# Altium schematic sheet Analog.SchDoc
size 381 x 241 mm
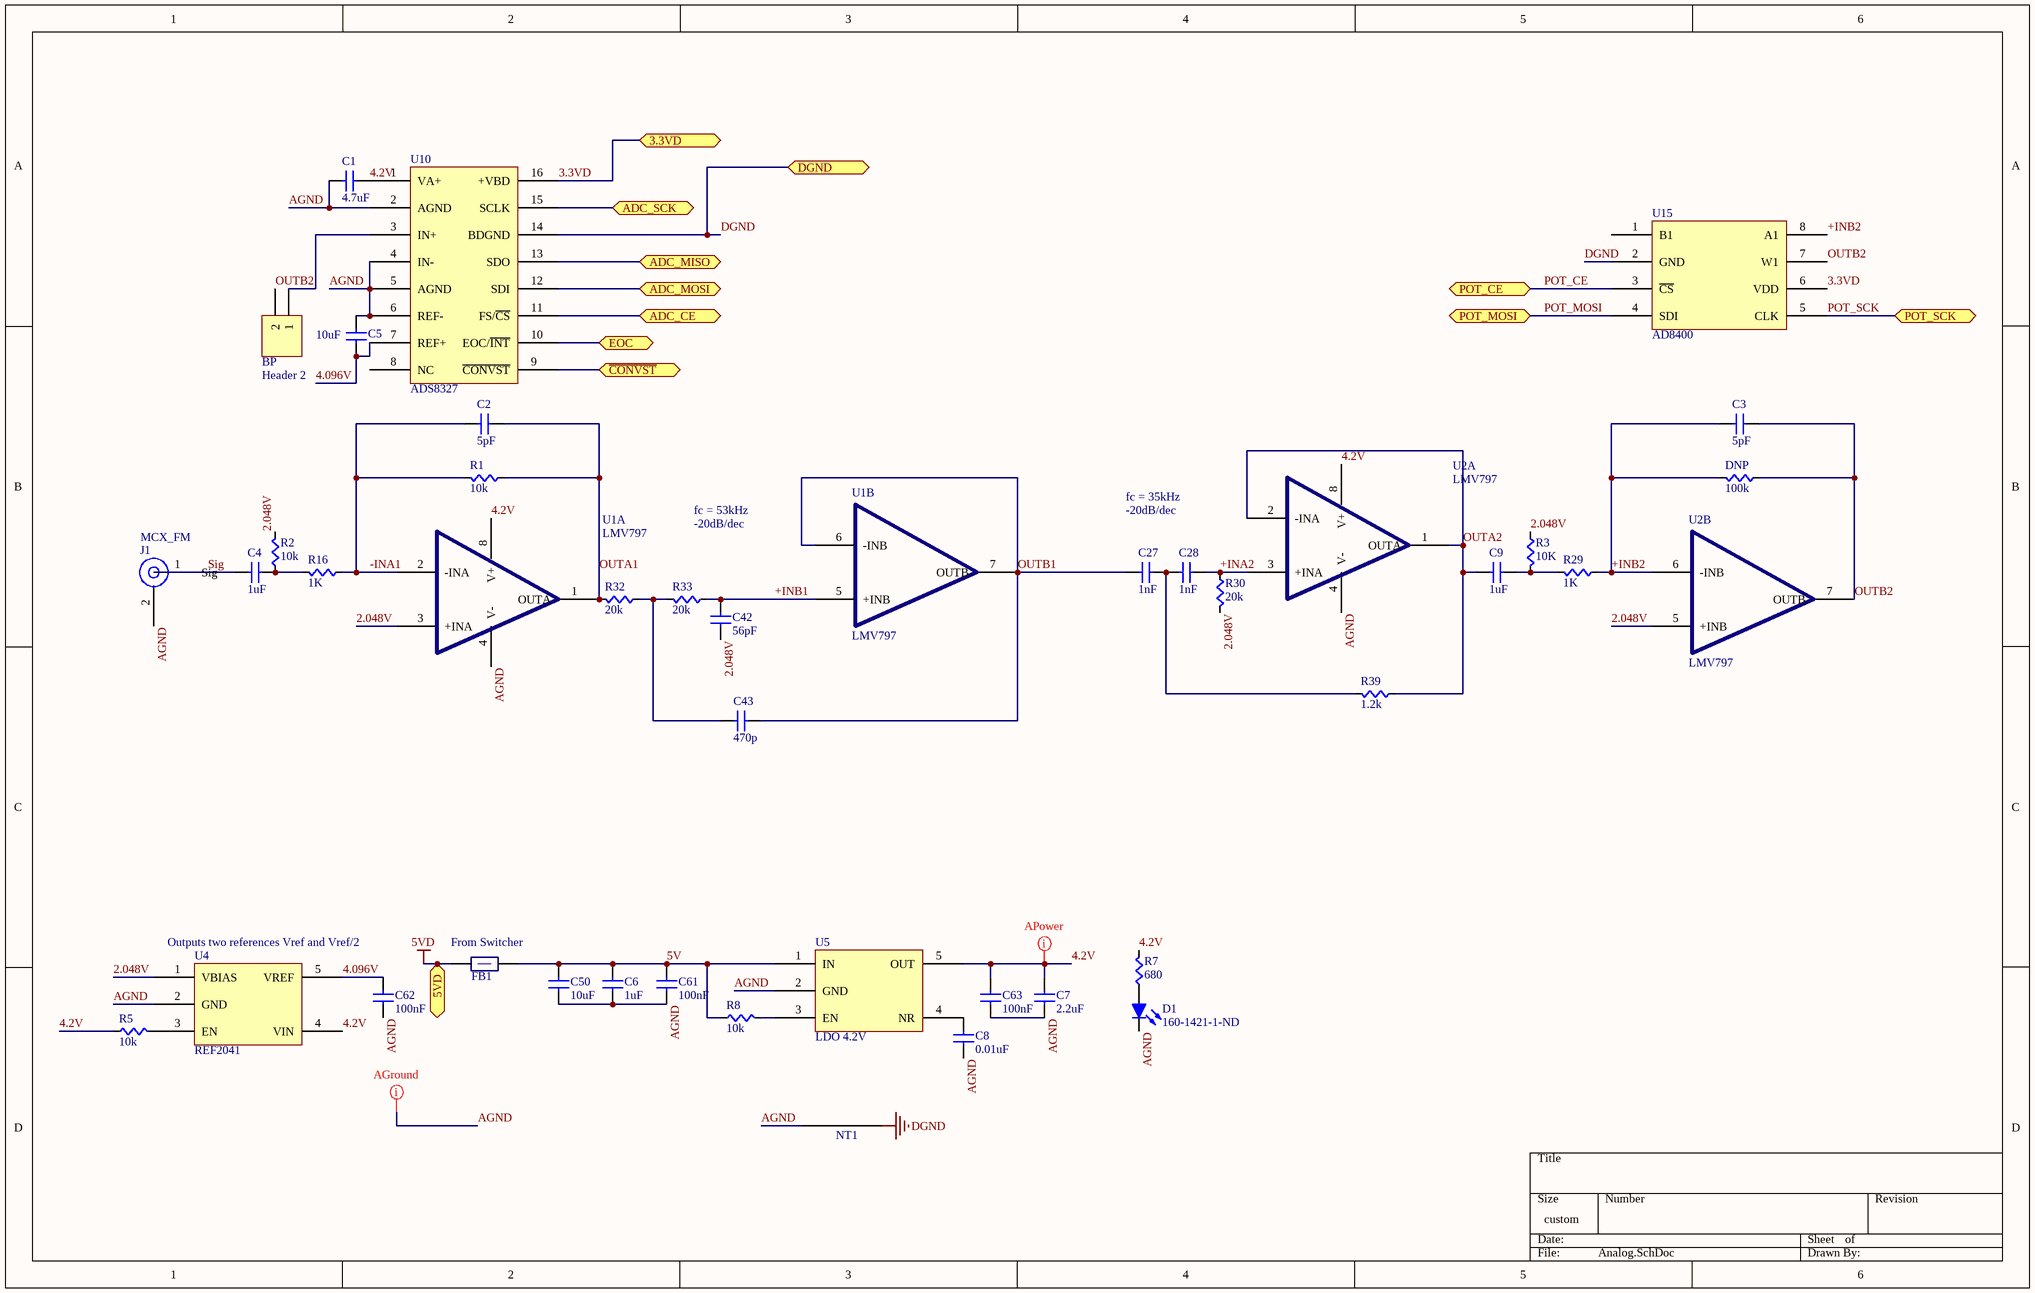
[diagram p0: Analog.SchDoc]

## Parts
BP  Header 2  [HDR1X2]
C1  value 4.7uF  [CAPC0603]  (hidden comment: Cap)
C2  value 5pF  [CAPC0603]  (hidden comment: Cap)
C3  value 5pF  [CAPC0603]  (hidden comment: Cap)
C4  value 1uF  [CAPC0603]  (hidden comment: Cap)
C5  value 10uF  [CAPC0603]  (hidden comment: Cap)
C6  value 1uF  [CAPC0603]  (hidden comment: Cap)
C7  value 2.2uF  [CAPC0603]  (hidden comment: Cap)
C8  value 0.01uF  [CAPC0603]  (hidden comment: Cap)
C9  value 1uF  [CAPC0603]  (hidden comment: Cap)
C27  value 1nF  [CAPC0603]  (hidden comment: Cap)
C28  value 1nF  [CAPC0603]  (hidden comment: Cap)
C42  value 56pF  [CAPC0603]  (hidden comment: Cap)
C43  value 470p  [CAPC0603]  (hidden comment: Cap)
C50  value 10uF  [CAPC0603]  (hidden comment: Cap)
C61  value 100nF  [CAPC0603]  (hidden comment: Cap)
C62  value 100nF  [CAPC0603]  (hidden comment: Cap)
C63  value 100nF  [CAPC0603]  (hidden comment: Cap)
D1  Supplier Part Number 1: 160-1421-1-ND  [LED0805-RED]  (hidden comment: LED-RED)
DNP  value 100k  [RES0603]  (hidden comment: Res)
FB1  FBead  [RES0603]  (value not drawn)
J1  MCX_FM  [MCX_FEMALE]
NT1  NetTie  [NT_5mil]  (value not drawn)  (net tie, no BOM)
R1  value 10k  [RES0603]  (hidden comment: Res)
R2  value 10k  [RES0603]  (hidden comment: Res)
R3  value 10K  [RES0603]  (hidden comment: Res)
R5  value 10k  [RES0603]  (hidden comment: Res)
R7  value 680  [RES0603]  (hidden comment: Res)
R8  value 10k  [RES0603]  (hidden comment: Res)
R16  value 1K  [RES0603]  (hidden comment: Res)
R29  value 1K  [RES0603]  (hidden comment: Res)
R30  value 20k  [RES0603]  (hidden comment: Res)
R32  value 20k  [RES0603]  (hidden comment: Res)
R33  value 20k  [RES0603]  (hidden comment: Res)
R39  value 1.2k  [RES0603]  (hidden comment: Res)
U1  LMV797  [TSSOP-8N]  (parts A,B of 2)
U2  LMV797  [TSSOP-8N]  (parts A,B of 2)
U4  REF2041  [SOT23-5]
U5  LDO 4.2V  [sot23-5]
U10  ADS8327  [TSSOP-16pin]
U15  AD8400  [SOIC-8PIN]

## Ports
3.3VD (bidir), 5VD (bidir), ADC_CE (bidir), ADC_MISO (bidir), ADC_MOSI (bidir), ADC_SCK (bidir), DGND (bidir), EOC (bidir), POT_CE (bidir), POT_MOSI (bidir), POT_SCK (bidir), ~{CONVST} (bidir)

## Nets
5VD: FB1.1(A) ; port 5VD
DGND: NT1.2 U10.14(BDGND) U15.2(GND) ; port DGND
2.048V: C42.1(A) R2.1(A) R3.2(B) R30.1(A) U1.3(+INA) U2.5(+INB) U4.1(VBIAS)
3.3VD: U10.16(+VBD) U15.6(VDD) ; port 3.3VD
4.2V: C1.2(B) C7.2(B) C63.1(A) R5.2(B) R7.1(A) U1.8(V+) U2.8(V+) U4.4(VIN) U5.5(OUT) U10.1(VA+)
4.096V: C5.2(B) C62.1(A) U4.5(VREF) U10.7(REF+)
5V: C6.2(B) C50.1(A) C61.1(A) FB1.2(B) R8.2(B) U5.1(IN)
+INA2: C28.2(B) R30.2(B) U2.3(+INA)
+INB1: C42.2(B) R33.2(B) U1.5(+INB)
+INB2: C3.1(A) DNP.1(A) R29.2(B) U2.6(-INB) U15.8(A1)
-INA1: C2.1(A) R1.1(A) R16.2(B) U1.2(-INA)
ADC_CE: U10.11(FS/~{CS}) ; port ADC_CE
ADC_MISO: U10.13(SDO) ; port ADC_MISO
ADC_MOSI: U10.12(SDI) ; port ADC_MOSI
ADC_SCK: U10.15(SCLK) ; port ADC_SCK
AGND: C1.1(A) C5.1(A) C6.1(A) C7.1(A) C8.1(A) C50.2(B) C61.2(B) C62.2(B) C63.2(B) D1.1(K) J1.2(GND) NT1.1 U1.4(V-) U2.4(V-) U4.2(GND) U5.2(GND) U10.2(AGND) U10.4(IN-) U10.5(AGND) U10.6(REF-)
~{CONVST}: U10.9(~{CONVST}) ; port ~{CONVST}
EOC: U10.10(EOC/~{INT}) ; port EOC
OUTA1: C2.2(B) R1.2(B) R32.1(A) U1.1(OUTA)
OUTA2: C9.1(A) R39.2(B) U2.1(OUTA) U2.2(-INA)
OUTB1: C27.1(A) C43.1(A) U1.6(-INB) U1.7(OUTB)
OUTB2: BP.2 C3.2(B) DNP.2(B) U2.7(OUTB) U15.7(W1)
POT_CE: U15.3(~{CS}) ; port POT_CE
POT_MOSI: U15.4(SDI) ; port POT_MOSI
POT_SCK: U15.5(CLK) ; port POT_SCK
Sig: C4.1(A) J1.1(Sig)
NetBP_1: BP.1 U10.3(IN+)
NetC4_2: C4.2(B) R2.2(B) R16.1(A)
NetC8_2: C8.2(B) U5.4(NR)
NetC9_2: C9.2(B) R3.1(A) R29.1(A)
NetC27_2: C27.2(B) C28.1(A) R39.1(A)
NetC43_2: C43.2(B) R32.2(B) R33.1(A)
NetD1_2: D1.2(A) R7.2(B)
NetR5_1: R5.1(A) U4.3(EN)
NetR8_1: R8.1(A) U5.3(EN)

Not connected (* = marked no-connect by the designer): U10 8(NC); U15 1(B1)

## Layout directives
net class AGround: AGND
net class APower: 4.2V

## Notes on the sheet
- fc = 35kHz
- fc = 53kHz
- -20dB/dec
- Outputs two references Vref and Vref/2
- (near FB1) From Switcher

## Library data of the parts
BP = Header 2: Header, 2-Pin; LatestRevisionDate: 17-Jul-2002; LatestRevisionNote: Re-released for DXP Platform.; Publisher: Altium Limited; Supplier Part Number 1: A1921-ND; Supplier 1: Digi-Key
D1 = LED-RED: Light Emitting Diode - RED; Manufacturer Part Number: LTST-C171CKT; Manufacturer: Lite-On Inc; Voltage - Forward (Vf) Typ: 1.8V; Current - Test: 20mA; Millicandela Rating: 25mcd; Viewing Angle: 130°; Color: Red; Supplier 1: Digi-Key; Package / Case: 0805 (2012 Metric)
FB1 = FBead: Ferrite Bead; Supplier 1: Digi-Key; Supplier Part Number 1: 445-2988-1-ND
J1 = MCX_FEMALE: MCX female receptacle RA; Supplier 1: Digi-Key; Supplier Part Number 1: A98546-ND
NT1 = NetTie: Ties two nets together
U1 U2 = LMV797: IC OPAMP GP 17MHZ RRO 8VSSOP; Supplier 1: Digi-Key; Supplier Part Number 1: LMV797MM/NOPBCT-ND
U4 = REF2041: IC VREF SERIES 2.05V/4.096V 5SOT; Supplier 1: Digi-Key; Supplier Part Number 1: 296-38497-1-ND
U5 = LDO 4.2V 200mA: IC REG LDO 4.2V 0.2A 5SOT; Supplier 1: Digi-Key; Supplier Part Number 1: 296-32585-1-ND
U10 = ADC 16bit 500k: IC ADC 16BIT 500KSPS 16-TSSOP; Supplier 1: Digi-Key; Supplier Part Number 1: 296-19764-ND
U15 = AD8400: IC DGTL POT 8BIT 100K 1CH 8-SOIC; Supplier 1: Digi-Key; Supplier Part Number 1: AD8400ARZ100-ND
C1-C9 C27 C28 C42 C43 C50 C61-C63 = Cap: Supplier 1: Digi-Key; Supplier Part Number 1: 1276-1000-1-ND
DNP R1-R3 R5 R7 R8 R16 R29 R30 R32 R33 R39 = Res: Supplier 1: Digi-Key; Supplier Part Number 1: RMCF0603JT10K0CT-ND